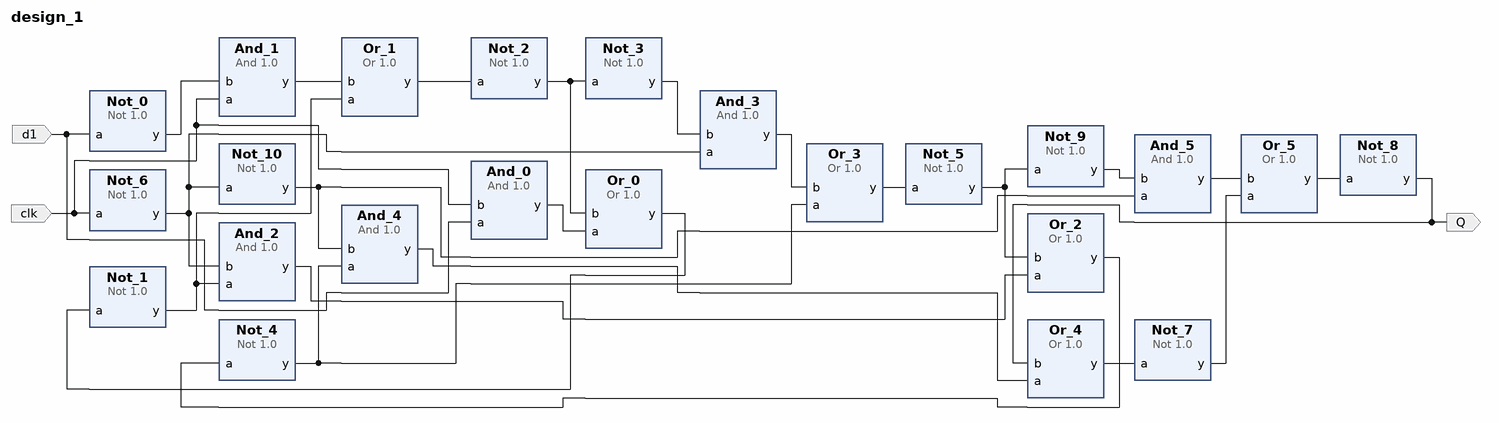
[diagram p0: block diagram of the top level]
# Vivado block design design_1, xc7a35tcsg324-1, Vivado 2025.1
create_bd_design design_1

create_bd_port -dir I clk
create_bd_port -dir I d1
create_bd_port -dir O Q

create_bd_cell -type ip -vlnv xilinx.com:user:And:1.0 And_0
create_bd_cell -type ip -vlnv xilinx.com:user:Not:1.0 Not_0
create_bd_cell -type ip -vlnv xilinx.com:user:Or:1.0 Or_0
create_bd_cell -type ip -vlnv xilinx.com:user:Or:1.0 Or_1
create_bd_cell -type ip -vlnv xilinx.com:user:Not:1.0 Not_1
create_bd_cell -type ip -vlnv xilinx.com:user:Not:1.0 Not_2
create_bd_cell -type ip -vlnv xilinx.com:user:And:1.0 And_1
create_bd_cell -type ip -vlnv xilinx.com:user:Or:1.0 Or_2
create_bd_cell -type ip -vlnv xilinx.com:user:Or:1.0 Or_3
create_bd_cell -type ip -vlnv xilinx.com:user:Not:1.0 Not_3
create_bd_cell -type ip -vlnv xilinx.com:user:Not:1.0 Not_4
create_bd_cell -type ip -vlnv xilinx.com:user:Not:1.0 Not_5
create_bd_cell -type ip -vlnv xilinx.com:user:And:1.0 And_2
create_bd_cell -type ip -vlnv xilinx.com:user:And:1.0 And_3
create_bd_cell -type ip -vlnv xilinx.com:user:Not:1.0 Not_6
create_bd_cell -type ip -vlnv xilinx.com:user:And:1.0 And_4
create_bd_cell -type ip -vlnv xilinx.com:user:And:1.0 And_5
create_bd_cell -type ip -vlnv xilinx.com:user:Or:1.0 Or_4
create_bd_cell -type ip -vlnv xilinx.com:user:Or:1.0 Or_5
create_bd_cell -type ip -vlnv xilinx.com:user:Not:1.0 Not_7
create_bd_cell -type ip -vlnv xilinx.com:user:Not:1.0 Not_8
create_bd_cell -type ip -vlnv xilinx.com:user:Not:1.0 Not_9
create_bd_cell -type ip -vlnv xilinx.com:user:Not:1.0 Not_10

# ---- connections ----

connect_bd_net [get_bd_pins And_0/y] [get_bd_pins Or_0/a]
connect_bd_net [get_bd_pins And_1/y] [get_bd_pins Or_1/b]
connect_bd_net [get_bd_pins And_2/y] [get_bd_pins Or_2/a]
connect_bd_net [get_bd_pins And_3/y] [get_bd_pins Or_3/b]
connect_bd_net [get_bd_pins And_4/y] [get_bd_pins Or_4/a]
connect_bd_net [get_bd_pins And_5/y] [get_bd_pins Or_5/b]
connect_bd_net [get_bd_ports clk] [get_bd_pins And_0/b] [get_bd_pins And_1/a] [get_bd_pins Not_6/a]
connect_bd_net [get_bd_pins Not_0/y] [get_bd_pins And_1/b]
connect_bd_net [get_bd_pins Not_10/y] [get_bd_pins And_4/b] [get_bd_pins And_5/a]
connect_bd_net [get_bd_pins Not_1/y] [get_bd_pins Or_1/a] [get_bd_pins And_2/a]
connect_bd_net [get_bd_pins Not_2/y] [get_bd_pins Or_0/b] [get_bd_pins Not_3/a]
connect_bd_net [get_bd_pins Not_3/y] [get_bd_pins And_3/b]
connect_bd_net [get_bd_pins Not_4/y] [get_bd_pins Or_3/a] [get_bd_pins And_4/a]
connect_bd_net [get_bd_pins Not_5/y] [get_bd_pins Or_2/b] [get_bd_pins Not_9/a]
connect_bd_net [get_bd_pins Not_6/y] [get_bd_pins Not_10/a] [get_bd_pins And_2/b] [get_bd_pins And_3/a]
connect_bd_net [get_bd_pins Not_7/y] [get_bd_pins Or_5/a]
connect_bd_net [get_bd_pins Not_8/y] [get_bd_pins Or_4/b] [get_bd_ports Q]
connect_bd_net [get_bd_pins Not_9/y] [get_bd_pins And_5/b]
connect_bd_net [get_bd_pins Or_0/y] [get_bd_pins Not_1/a]
connect_bd_net [get_bd_pins Or_1/y] [get_bd_pins Not_2/a]
connect_bd_net [get_bd_pins Or_2/y] [get_bd_pins Not_4/a]
connect_bd_net [get_bd_pins Or_3/y] [get_bd_pins Not_5/a]
connect_bd_net [get_bd_pins Or_4/y] [get_bd_pins Not_7/a]
connect_bd_net [get_bd_pins Or_5/y] [get_bd_pins Not_8/a]
connect_bd_net -net d1_1 [get_bd_ports d1] [get_bd_pins Not_0/a] [get_bd_pins And_0/a]

validate_bd_design
save_bd_design
